# Altium schematic sheet Do-an.SchDoc
size 355 x 241 mm; SheetNumber: 1; SheetTotal: 1
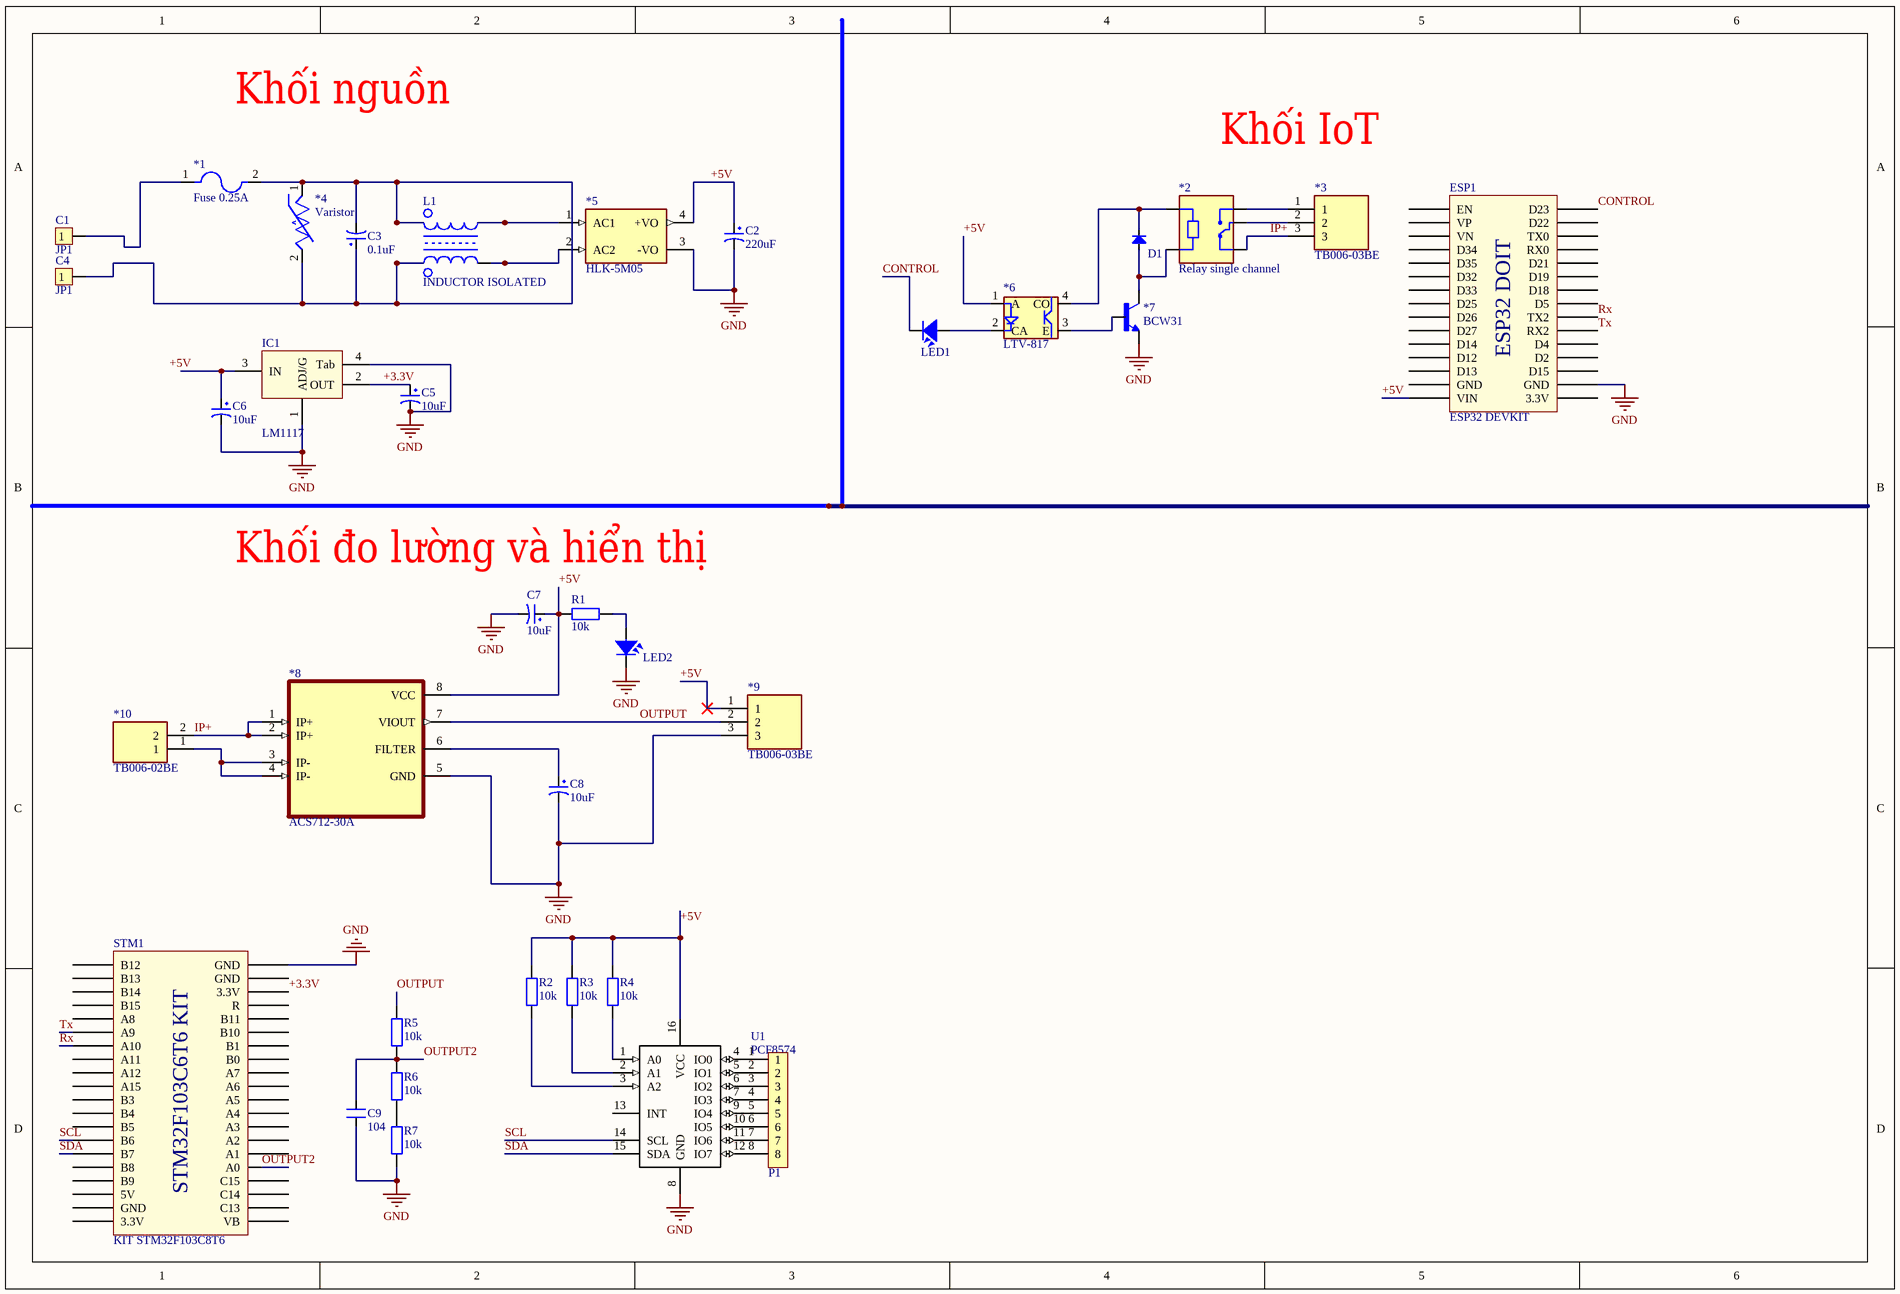
[diagram p0: Do-an.SchDoc]

## Parts
*1  Fuse 0.25A  [FUSC6125X279N]
*2  Relay single channel  [RELAY_SRD-05VDC-SL-C]
*3  TB006-03BE  [CUI_TB006 -508-03BE]
*4  Varistor  [VAR_B72220P3141K101]
*5  HLK-5M05  [CONV_HLK-5M05]
*6  LTV-817  [LTV-817]
*7  BCW31  [SOT23-BEC]
*8  ACS712-30A  [SOIC127P600X175-8N - duplicate]
*9  TB006-03BE  [CUI_TB006 -508-03BE]
*10  TB006-02BE  [CUI_TB006-508-02BE]
C1  JP1  [JP1-D1T]
C2  220uF  [CP1.5/3.4]  (net tie, no BOM)
C3  0.1uF  [CP1/2]
C4  JP1  [JP1-D1T]
C5  10uF  [CP1/2]  (net tie, no BOM)
C6  10uF  [CP1/2]
C7  10uF  [CP1/2]
C8  10uF  [CP1/2]  (net tie, no BOM)
C9  104  [CN2]
D1  Diode  [DIO-1A]  (value not drawn)
ESP1  ESP32 DEVKIT  [ESP32 WROOM 32 KIT]
IC1  LM1117  [SOT223-4N]
L1  INDUCTOR ISOLATED  [INDUCTOR COMPACT]
LED1  LED  [LED 3512]  (value not drawn)
LED2  LED  [LED-3MM-YELLOW]  (value not drawn)
P1  BIG Heager 8  [BIG_Header 8]  (value not drawn)
R1  10k  [RES-1/4W]
R2  10k  [RES-1/4W]
R3  10k  [RES-1/4W]
R4  10k  [RES-1/4W]
R5  10k  [RES-1/4W]
R6  10k  [RES-1/4W]
R7  10k  [RES-1/4W]
STM1  KIT STM32F103C8T6  [STM32F103 KIT]
U1  PCF8574  [DIP16]

## Nets
GND: *5.3(-VO) *7.E *8.5(GND) *9.3 C2.2 C5.2 C6.2 C7.2 C8.2 C9.1 ESP1.17(GND) IC1.1(ADJ/G) IC1.4(Tab) LED2.2 R7.1 STM1.40(GND) U1.8(GND)
+3.3V: C5.1 IC1.2(OUT) STM1.38(3.3V)
+5V: *5.4(+VO) *6.1(A) *8.8(VCC) *9.1 C2.1 C6.1 C7.1 ESP1.15(VIN) IC1.3(IN) R1.2 R2.2 R3.2 R4.2 U1.16(VCC)
CONTROL: ESP1.30(D23) LED1.2
IP+: *2.NC *3.3 *8.1(IP+) *8.2(IP+) *10.2
OUTPUT: *8.7(VIOUT) *9.2 R5.2
OUTPUT2: C9.2 R5.1 R6.2 STM1.25(A0)
Rx: ESP1.22(TX2) STM1.7(A10)
SCL: STM1.14(B6) U1.14(SCL)
SDA: STM1.15(B7) U1.15(SDA)
Tx: ESP1.21(RX2) STM1.6(A9)
Net*1_1: *1.1 C1.1
Net*1_2: *1.2 *4.1 *4.2 C3.1 C3.2 C4.1 L1.1 L1.3
Net*2_A1: *2.A1 *6.4(CO) D1.2(K)
Net*2_A2: *2.A2 *7.C D1.1(A)
Net*2_COM: *2.COM *3.2
Net*2_NO: *2.NO *3.1
Net*5_1: *5.1(AC1) L1.4
Net*5_2: *5.2(AC2) L1.2
Net*6_2: *6.2(CA) LED1.1
Net*6_3: *6.3(E) *7.B
Net*8_3: *8.3(IP-) *8.4(IP-) *10.1
Net*8_6: *8.6(FILTER) C8.1
NetLED2_1: LED2.1 R1.1
NetP1_1: P1.1 U1.4(IO0)
NetP1_2: P1.2 U1.5(IO1)
NetP1_3: P1.3 U1.6(IO2)
NetP1_4: P1.4 U1.7(IO3)
NetP1_5: P1.5 U1.9(IO4)
NetP1_6: P1.6 U1.10(IO5)
NetP1_7: P1.7 U1.11(IO6)
NetP1_8: P1.8 U1.12(IO7)
NetR2_1: R2.1 U1.3(A2)
NetR3_1: R3.1 U1.2(A1)
NetR4_1: R4.1 U1.1(A0)
NetR6_1: R6.1 R7.2

Not connected (* = marked no-connect by the designer): ESP1 1(EN) 2(VP) 3(VN) 4(D34) 5(D35) 6(D32) 7(D33) 8(D25) 9(D26) 10(D27) 11(D14) 12(D12) 13(D13) 14(GND) 16(3.3V) 18(D15) 19(D2) 20(D4) 23(D5) 24(D18) 25(D19) 26(D21) 27(RX0) 28(TX0) 29(D22); STM1 1(B12) 2(B13) 3(B14) 4(B15) 5(A8) 8(A11) 9(A12) 10(A15) 11(B3) 12(B4) 13(B5) 16(B8) 17(B9) 18(5V) 19(GND) 20(3.3V) 21(VB) 22(C13) 23(C14) 24(C15) 26(A1) 27(A2) 28(A3) 29(A4) 30(A5) 31(A6) 32(A7) 33(B0) 34(B1) 35(B10) 36(B11) 37(R) 39(GND); U1 13(INT)

## Notes on the sheet
- Khối nguồn
- Khối IoT
- Khối đo lường và hiển thị
- (in symbol ESP32 WROOM 32 KIT) ESP32 DOIT
- (in symbol STM32f103 Bluepill) STM32F103C6T6 KIT

## Library data of the parts
C1 C4 = JP1: WR-PHD 2.54 mm Angled Socket Header; Manufacturer: W¨¹rth Elektronik eiSos GmbH; partNo: 613002143121; ComponentLink1 Description: Manufacturer; ComponentLink2 Description: Datasheet; NoPins: 02; Created Date: 29 March 2013; ComponentLink1URL: http://www.we-online.com; ComponentLink2URL: http://katalog.we-online.de/em/datasheet/6130xx143121.pdf; Created by: Karrer Zheng
C2 = CP3: Cap 100uF/35V - 470uF/16V; Value: 100uF/35V/50V; Description 1: 1000uF/6,3V - 470uF/16V - 330uF - 25V; Description 2: 220uF/35V - 100uF/50V - 63V - 4,7uF/200V; Description 3: 22uF => 33uF100V - 3,3uF => 4,7uF/250V; Description 4: 2,2uF =>3,3uF/350 - 2,2uF/400V - 1uF/450V
C3 C5-C8 = CP1: Cap P  0,1uF < 22uF , 16 - 50V; Value: 10uF/50V; Description 1: 10 => 220uF/6,3V/10V - 10uF => 100uF/16V; Description 2: 0,1uF => 33uF/50V - 10uF => 22uF/63V; Description 3: 0,47uF => 10uF/100V
C9 = CN2: Cap np 104 => 105pF; Value: 0.1uF
D1 = Diode: Default Diode; Code - JEDEC: DO-214-AB; Value: 1N5007; Published: 8-Jun-2000; Revision: July-2002: Re-released for DXP Platform.; Publisher: Altium Limited
ESP1 = ESP32 WROOM 32 KIT
IC1 = LM1117: 3v3; Value: LM317
LED1 = LED SMD: Value: LED 3 - 5 ly 2 Colour
LED2 = LED: LED Single colour Green and Red; Value: LED 3 ly Single Colour
P1 = BIG_Header 8
R1-R7 = RES 1/4W: Resistor 1/4W; Value: R1/4W - 1K
STM1 = STM32f103 Bluepill: KIT STM32F103C8T6 Bluepill
U1 = PCF8574: I2C PORT EXPANDER; Manufacturer Part Number: PCF8574T/3,512; Manufacturer: NXP Semiconductors; Includes: POR; Interface: I²C; Interrupt Output: Yes; Number of I /O: 8; Voltage - Supply: 2.5 V ~ 6 V; Frequency - Clock: 100KHz; Supplier 1: Digi-Key; Supplier Part Number 1: 568-1076-5-ND; Package / Case: 16-SOIC (7.5mm Width); Category: Integrated Circuits (ICs); Supplier Part Number: 568-1076-5-ND; Operating Temperature: -40°C ~ 85°C; Packaging: Tube; RoHS: RoHS Compliant; Supplier: Digi-Key